# EAGLE design motherboard (EAGLE 7.1.0)
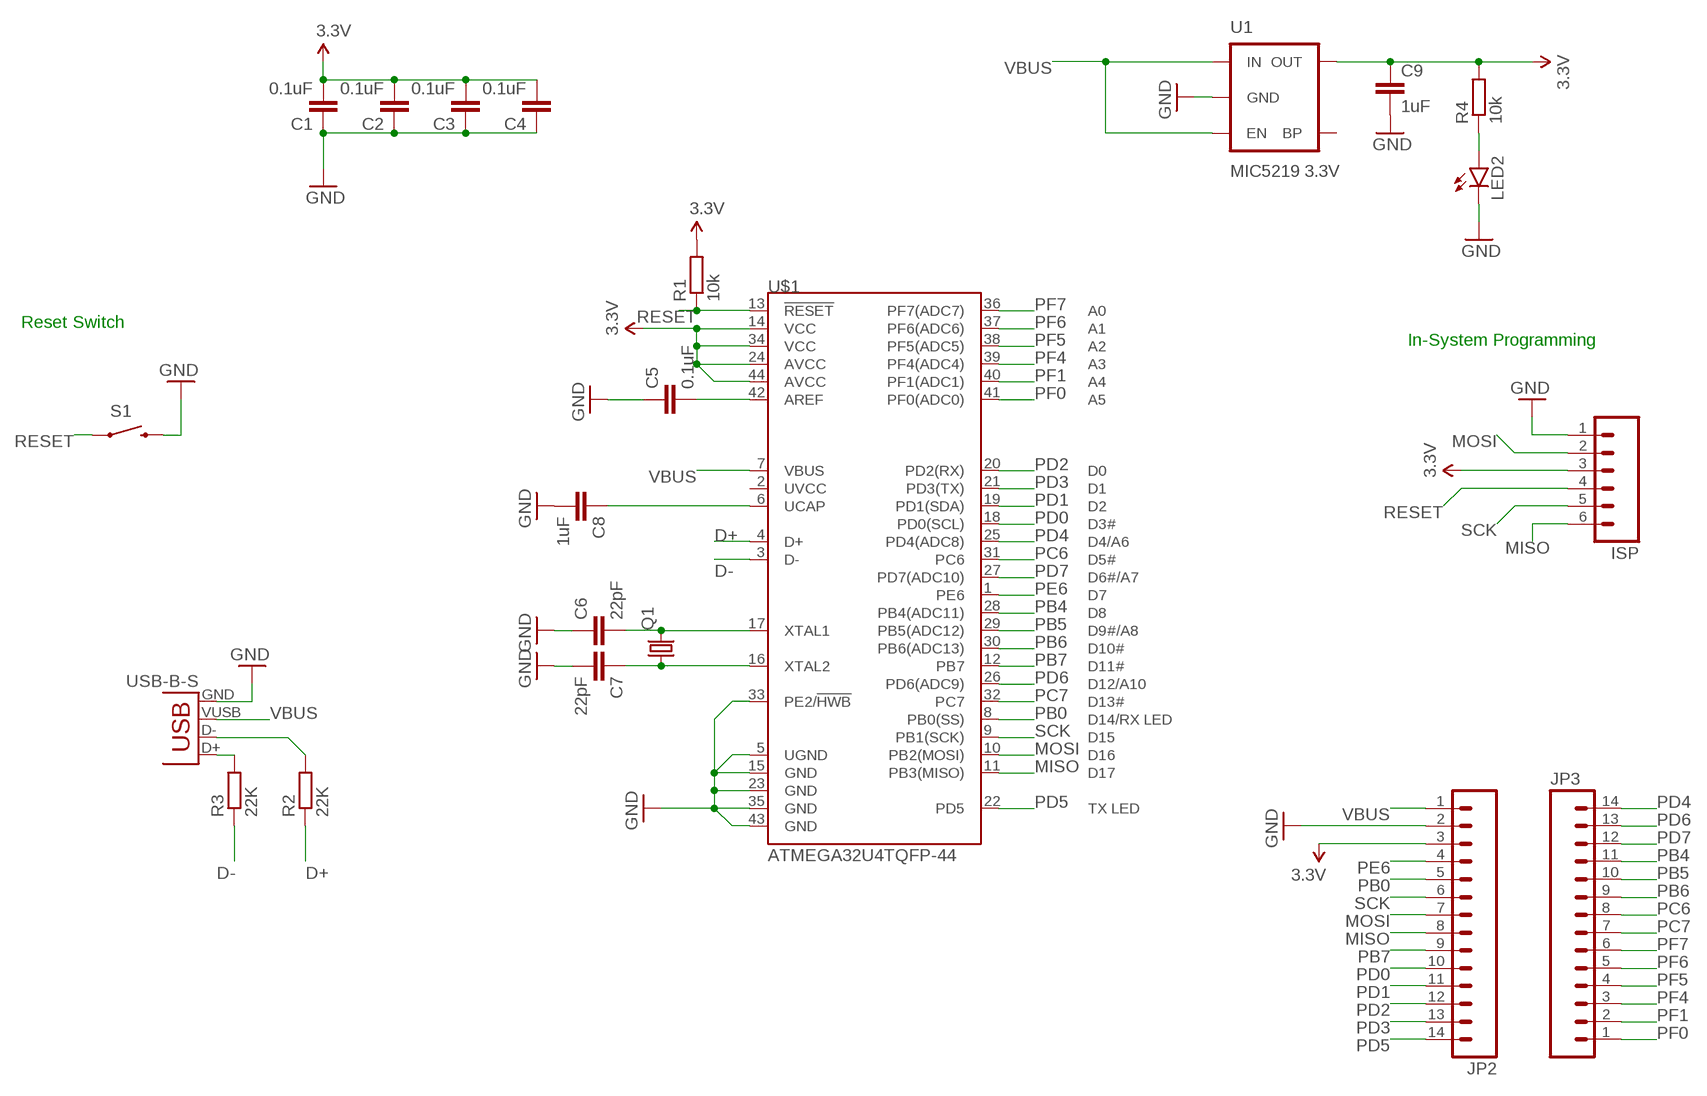
[diagram p0: schematic, sheet 1]

## Parts
C1  0.1uF  C0805  [C0805]
C2  0.1uF  C0805  [C0805]
C3  0.1uF  C0805  [C0805]
C4  0.1uF  C0805  [C0805]
C5  0.1uF  C0805  [C0805]
C6  22pF  C0805  [C0805]
C7  22pF  C0805  [C0805]
C8  1uF  C0805  [C0805]
C9  1uF  C0805  [C0805]
ISP  M06SMD  [1X06-SMD]
JP1  USB-B-S  [USB-B-SMT]
JP2  M14  [1X14]
JP3  M14  [1X14]
LED2  LED1206  [LED-1206]
Q1  CRYSTALHC49S  [HC49/S]
R1  10k  R0805  [R0805]
R2  22K  R0805  [R0805]
R3  22K  R0805  [R0805]
R4  10k  R0805  [R0805]
S1  SWITCH-MOMENTARY-2PTH  [TACTILE-PTH]
U1  MIC5219 3.3V  V_REG_MIC52193.3V  [SOT23-5]
U$1  ATMEGA32U4TQFP-44  [TQFP44]

## Nets
3.3V: C1.2 C2.2 C3.2 C4.2 C9.1 ISP.3 JP2.3 R1.2 R4.2 U1.5(OUT) U$1.14(VCC) U$1.24(AVCC) U$1.34(VCC) U$1.44(AVCC)
D+: R2.1 U$1.4(D+)
D-: R3.1 U$1.3(D-)
GND: C1.1 C2.1 C3.1 C4.1 C5.1 C6.1 C7.2 C8.2 C9.2 ISP.1 JP1.GND JP2.2 LED2.C S1.3 U1.2(GND) U$1.5(UGND) U$1.15(GND) U$1.23(GND) U$1.33(PE2/!HWB) U$1.35(GND) U$1.43(GND)
MISO: ISP.6 JP2.8 U$1.11(PB3(MISO))
MOSI: ISP.2 JP2.7 U$1.10(PB2(MOSI))
N$1: C7.1 Q1.1 U$1.16(XTAL2)
N$2: C5.2 U$1.42(AREF)
N$3: C6.2 Q1.2 U$1.17(XTAL1)
N$4: JP1.D+ R3.2
N$5: JP1.D- R2.2
N$6: LED2.A R4.1
N$10: C8.1 U$1.6(UCAP)
PB0: JP2.5 U$1.8(PB0(SS))
PB4: JP3.11 U$1.28(PB4(ADC11))
PB5: JP3.10 U$1.29(PB5(ADC12))
PB6: JP3.9 U$1.30(PB6(ADC13))
PB7: JP2.9 U$1.12(PB7)
PC6: JP3.8 U$1.31(PC6)
PC7: JP3.7 U$1.32(PC7)
PD0: JP2.10 U$1.18(PD0(SCL))
PD1: JP2.11 U$1.19(PD1(SDA))
PD2: JP2.12 U$1.20(PD2(RX))
PD3: JP2.13 U$1.21(PD3(TX))
PD4: JP3.14 U$1.25(PD4(ADC8))
PD5: JP2.14 U$1.22(PD5)
PD6: JP3.13 U$1.26(PD6(ADC9))
PD7: JP3.12 U$1.27(PD7(ADC10))
PE6: JP2.4 U$1.1(PE6)
PF0: JP3.1 U$1.41(PF0(ADC0))
PF1: JP3.2 U$1.40(PF1(ADC1))
PF4: JP3.3 U$1.39(PF4(ADC4))
PF5: JP3.4 U$1.38(PF5(ADC5))
PF6: JP3.5 U$1.37(PF6(ADC6))
PF7: JP3.6 U$1.36(PF7(ADC7))
RESET: ISP.4 R1.1 S1.1 U$1.13(!RESET)
SCK: ISP.5 JP2.6 U$1.9(PB1(SCK))
VBUS: JP1.VUSB(VBUS) JP2.1 U1.1(IN) U1.3(EN) U$1.7(VBUS)
Unconnected: U1.4(BP) U$1.2(UVCC)

## Notes on the sheet
- Reset Switch
- In-System Programming

## Library data of the parts
C1-C9 = ELL-i-Passives:C: Surface Mount Capasitors — in standard sizes A capacitor used to store energy electrostatically in an electric field. If you need a high-value capacitor, consider using a polarised capacitor to save space. Wikipedia article on capacitors <https://en.wikipedia.org/wiki/Capacitor>
ISP = SparkFun-Connectors:M06: Header 6 Standard 6-pin 0.1" header. Use with straight break away headers (SKU : PRT-00116), right angle break away headers (PRT-00553), swiss pins (PRT-00743), machine pins (PRT-00117), and female headers (PRT-00115). Molex polarized connector foot print use with SKU : PRT-08094 with associated crimp pins and housings. NOTES ON THE VARIANTS LOCK and LOCK_LONGPADS... This footprint was designed to help hold the alignment of a through-hole component (i.e. 6-pin header) while soldering it into place. You may notice that each hole has been shifted either up or down by 0.005 of an inch from it's more standard position (which is a perfectly straight line). This slight alteration caused the pins (the squares in the middle) to touch the edges of the holes. Because they are alternating, it causes a "brace" to hold the component in place. 0.005 has proven to be the perfect amount of "off-center" position when using our standard breakaway headers. Although looks a little odd when you look at the bare footprint, once you have a header in there, the alteration is very hard to notice. Also,if you push a header all the way into place, it is covered up entirely on the bottom side. This idea of altering the position of holes to aid alignment will be further integrated into the Sparkfun Library for other footprints. It can help hold any component with 3 or more connection pins.
JP1 = SparkFun-Connectors:USB: USB Connectors USB-B-PTH is fully proven SKU : PRT-00139/CONN-08278 USB-miniB is fully proven SKU : PRT-00587 USB-A-PCB is untested. USB-A-H is throughly reviewed, but untested. Spark Fun Electronics SKU : PRT-00437 USB-B-SMT is throughly reviewed, but untested. Needs silkscreen touching up. USB-A-S has not been used/tested USB-MB-H has not been used/tested USB-MICROB has been used. CONN-09505
JP2 JP3 = SparkFun-Connectors:M14: Header 14 Standard 14-pin 0.1" header. Use with straight break away headers (SKU : PRT-00116), right angle break away headers (PRT-00553), swiss pins (PRT-00743), machine pins (PRT-00117), and female headers (PRT-00115).
LED2 = SparkFun-LED:LED: LEDs Standard schematic elements and footprints for 5mm, 3mm, 1206, and 0603 sized LEDs. 5mm - Spark Fun Electronics SKU : COM-00529 (and others)
Q1 = adafruit:CRYSTAL: CRYSTAL; OC_FARNELL: 1667008; OC_NEWARK: unknown
R1-R4 = ELL-i-Passives:R: Surface Mount Resistor — in standard sizes
S1 = SparkFun-Electromechanical:SWITCH-MOMENTARY-2: Various NO switches- pushbuttons, reed, etc
U1 = SparkFun-PowerIC:V_REG_MIC5219: V_REG MIC5219 Standard 3.3V and 5V 500mA LDO voltage regulator in SOT-23 layout. Micrel part MIC5219. BP (by-pass) pin is used to lower output noise with 470pF cap, may be left open.; PROD_ID: VREG-09872
U$1 = SparkFun-DigitalIC:ATMEGA32U4: Atmel 44-pin 8-bit Microcontroller with 32KBytes of ISP Flash and USB Controller

## Board
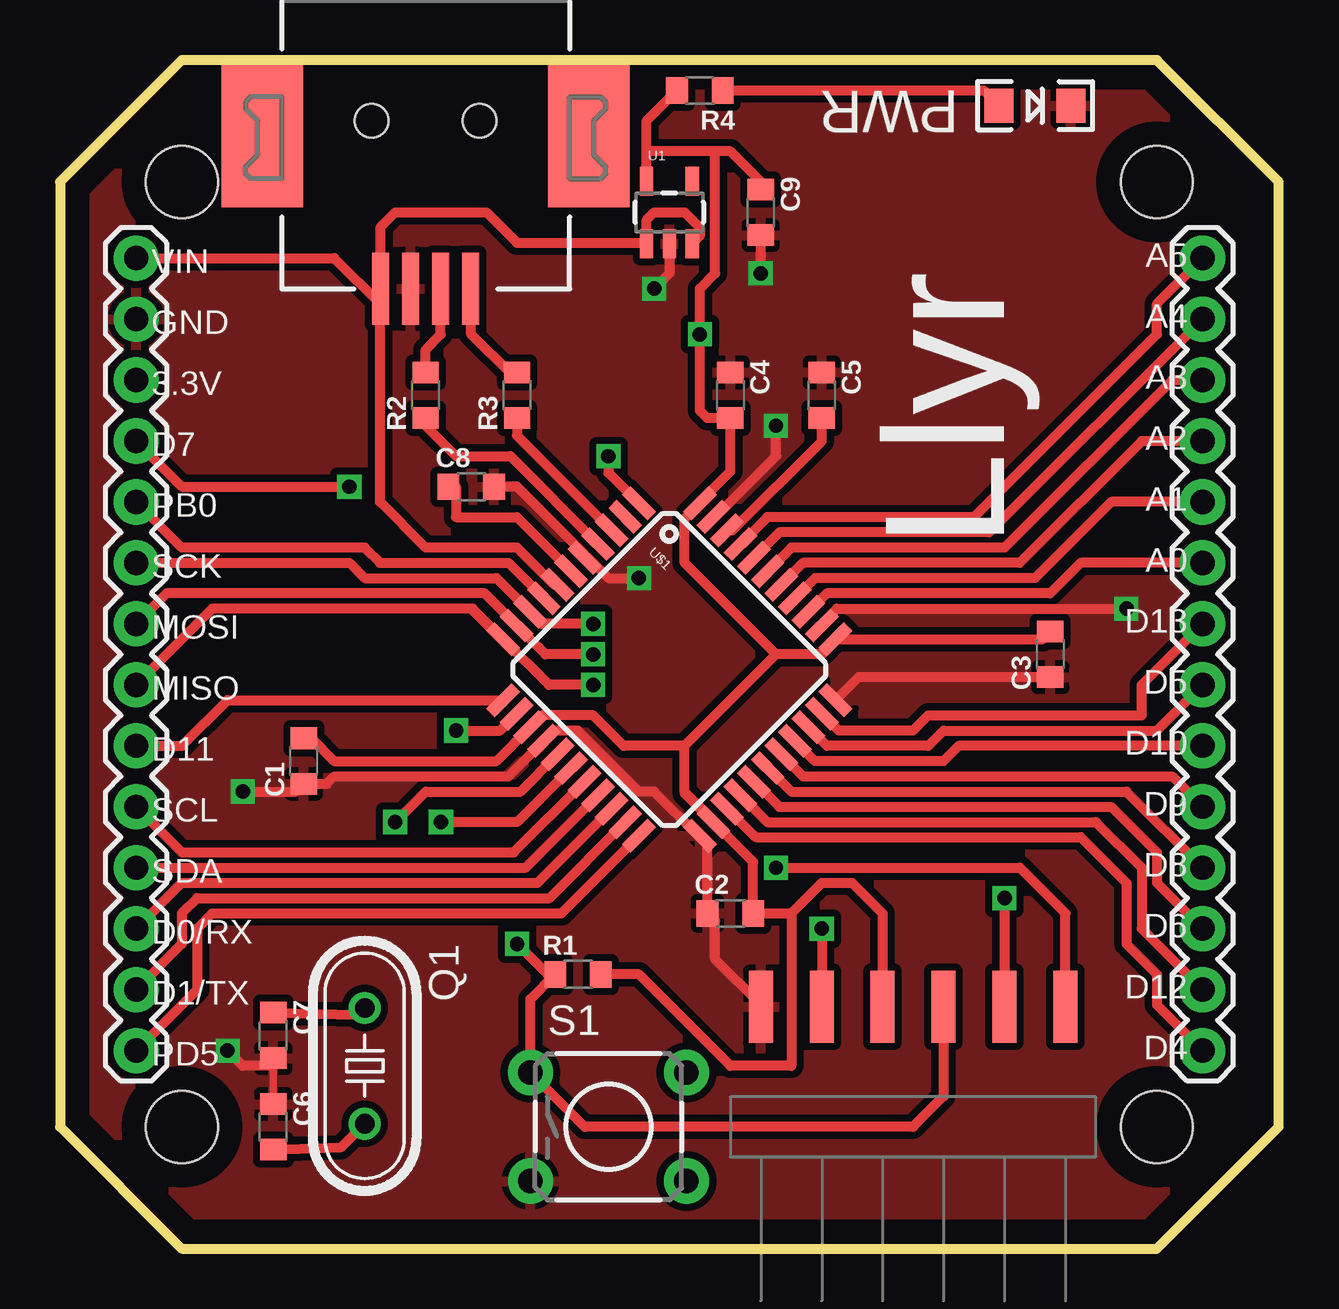
[diagram p1: board, top side]
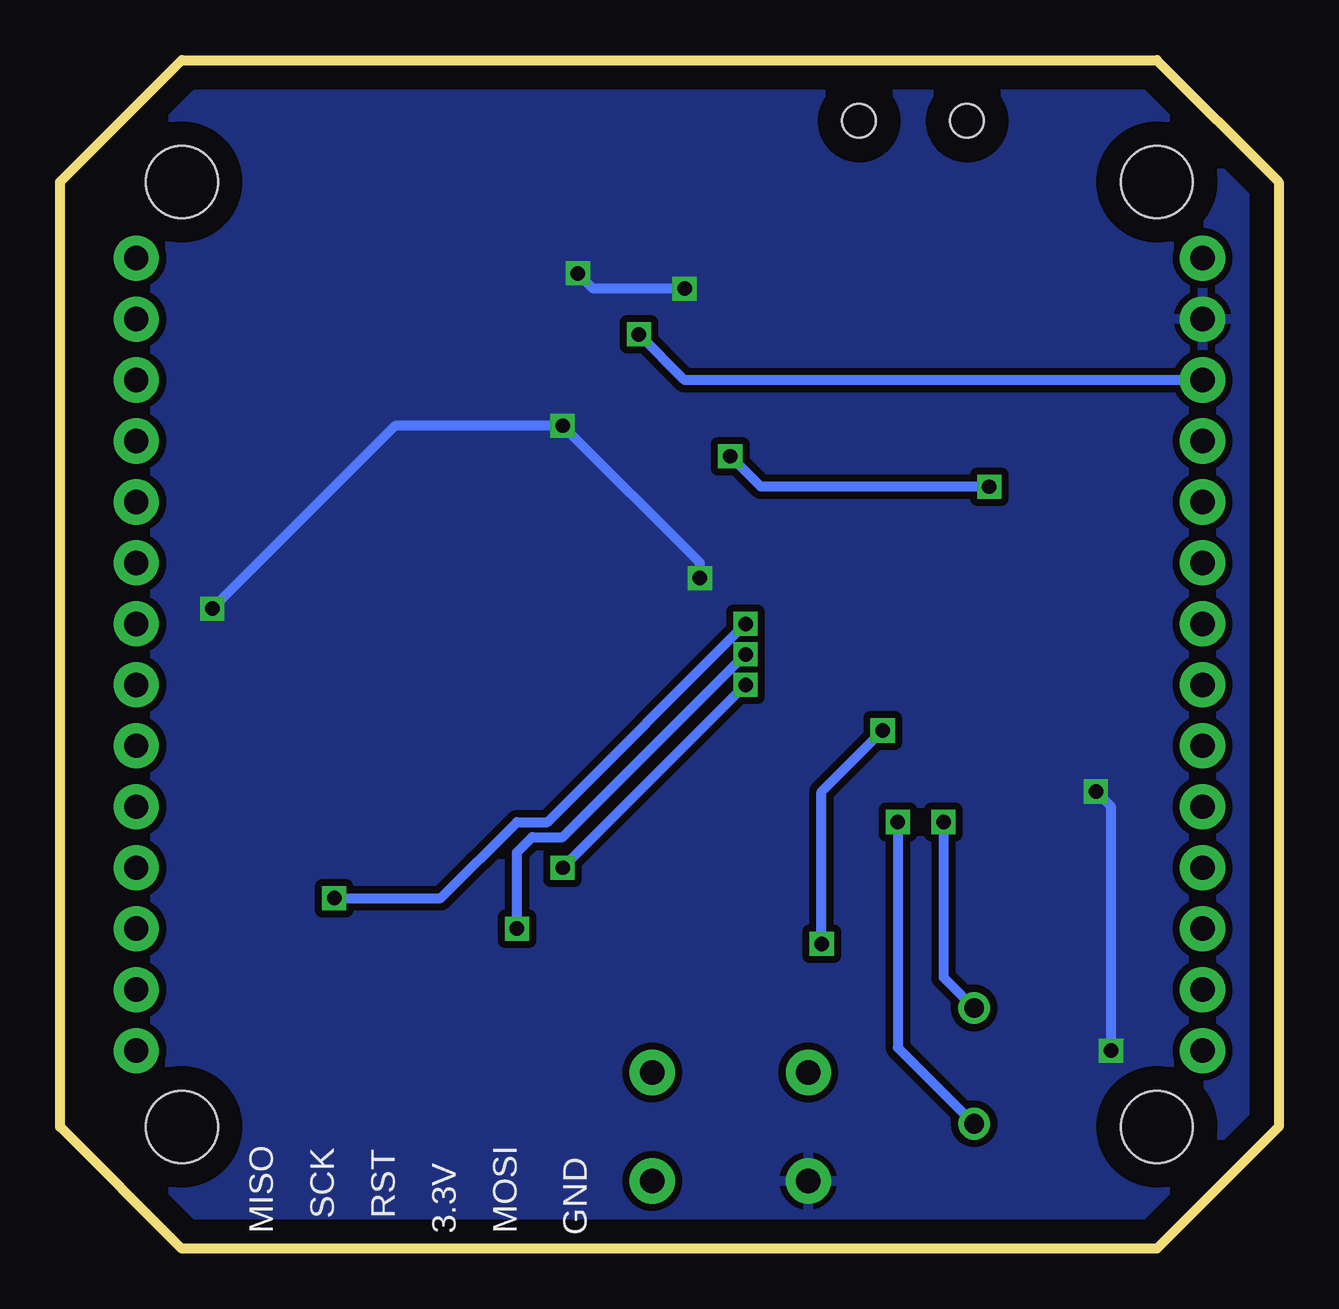
[diagram p2: board, bottom side, seen from below]

Size 50.8 x 49.53 mm. Coordinates in mm from the lower left corner, seen from the top.
Outline: 5.08,0 45.72,0 50.8,5.08 50.8,44.45 45.72,49.53 5.08,49.53 0,44.45 0,5.08 5.08,0
Copper layers (1*16): Top 0.035mm / dielectric 1.5mm / Bottom 0.035mm
Design rules "default": minimum track width 10mil, minimum drill 24mil, track to track 8mil, track to pad 8mil, pad to pad 8mil, via to via 8mil, smd to smd 8mil, copper to edge 40mil, drill to drill 8mil, minimum pad ring 10mil, minimum via ring 8mil, stop-mask expansion 4mil, vias tented up to drill 0mil, thermal gap 10mil
Holes 3 mm at 5.08,44.45 45.72,44.45 45.72,5.08 5.08,5.08

### Footprints (pad centres in the part's own frame; a part is rotated, then mirrored left to right if it is on the bottom)
C0805 = smd 0.9 x 1.1: 1 -0.95,0; 2 0.95,0
1X06-SMD = smd 1 x 3: 1 -6.35,5; 2 -3.81,5; 3 -1.27,5; 4 1.27,5; 5 3.81,5; 6 6.35,5
USB-B-SMT = smd 6.04 x 3.4: 5 0.58,6.8; 6 0.58,-6.8 | smd 3 x 0.7: D+ 7,1.875; D- 7,0.625; GND 7,-0.625; VUSB 7,-1.875 | hole 1.4: 0,2.25; 0,-2.25
1X14 = drill 1.016 pad 1.88: 1 0,0; 2 2.54,0; 3 5.08,0; 4 7.62,0; 5 10.16,0; 6 12.7,0; 7 15.24,0; 8 17.78,0; 9 20.32,0; 10 22.86,0; 11 25.4,0; 12 27.94,0; 13 30.48,0; 14 33.02,0
LED-1206 = smd 1.2 x 1.4: A -1.5,0; C 1.5,0
HC49/S = drill 0.813: 1 -2.413,0; 2 2.413,0
R0805 = smd 0.9 x 1.1: 1 -0.95,0; 2 0.95,0
TACTILE-PTH = drill 1.016 pad 1.88: 1 -3.251,2.261; 2 3.251,2.261; 3 -3.251,-2.261; 4 3.251,-2.261
SOT23-5 = smd 0.55 x 1.2: 1 -0.95,-1.3; 2 0,-1.3; 3 0.95,-1.3; 4 0.95,1.3; 5 -0.95,1.3
TQFP44 = smd 1.5 x 0.5: 1 -5.8,4; 2 -5.8,3.2; 3 -5.8,2.4; 4 -5.8,1.6; 5 -5.8,0.8; 6 -5.8,0; 7 -5.8,-0.8; 8 -5.8,-1.6; 9 -5.8,-2.4; 10 -5.8,-3.2; 11 -5.8,-4; 23 5.8,-4; 24 5.8,-3.2; 25 5.8,-2.4; 26 5.8,-1.6; 27 5.8,-0.8; 28 5.8,0; 29 5.8,0.8; 30 5.8,1.6; 31 5.8,2.4; 32 5.8,3.2; 33 5.8,4 | smd 0.5 x 1.5: 12 -4,-5.8; 13 -3.2,-5.8; 14 -2.4,-5.8; 15 -1.6,-5.8; 16 -0.8,-5.8; 17 0,-5.8; 18 0.8,-5.8; 19 1.6,-5.8; 20 2.4,-5.8; 21 3.2,-5.8; 22 4,-5.8; 34 4,5.8; 35 3.2,5.8; 36 2.4,5.8; 37 1.6,5.8; 38 0.8,5.8; 39 0,5.8; 40 -0.8,5.8; 41 -1.6,5.8; 42 -2.4,5.8; 43 -3.2,5.8; 44 -4,5.8

### Placement (x,y rotation side)
C1  10.16,20.32 90 top
C2  27.94,13.97 0 top
C3  41.28,24.76 90 top
C4  27.94,35.56 270 top
C5  31.75,35.56 270 top
C6  8.89,5.08 270 top
C7  8.89,8.89 270 top
C8  17.14,31.75 0 top
C9  29.21,43.18 270 top
ISP  35.56,5.08 0 top
JP1  15.24,46.99 270 top
JP2  3.17,41.28 270 top
JP3  47.62,41.28 270 top
LED2  40.64,47.62 0 top
Q1  12.7,7.62 270 top
R1  21.59,11.43 0 top
R2  15.24,35.56 90 top
R3  19.05,35.56 90 top
R4  26.67,48.26 180 top
S1  22.86,5.08 0 top
U1  25.4,43.18 0 top
U$1  25.4,24.13 315 top

### Tracks (layer width: path | path; a pad name or v marks a point on that pad's centre or on a via)
3.3V  (via drill 0.6)
  Top 0.406: U$1.44 26.61,31.06 | U$1.44 26.67,31.12 27.94,32.39 C4.2 | C3.2 40.96,25.4 U$1.34 32.33,25.35 31.75,24.76 29.84,24.76 | U$1.24 28.89,16.11 C2.2 30.48,13.97 | C1.2 10.48,21.27 11.43,20.32 18.2,20.32 U$1.14 20.1,22.22 22.22,22.22 23.5,20.95 26.04,20.95 | 30.48,13.97 31.75,15.24 33.02,15.24 34.29,13.97 ISP.3 | C4.2 28.26,34.61 | U1.5 24.45,45.72 | 24.45,45.72 24.45,46.99 R4.2 | C9.1 29.21,44.45 27.94,45.72 27.3,45.72 | 27.3,45.72 24.45,45.72 | C4.2 26.98,34.61 26.67,34.92 v26.67,38.1 26.67,40 27.3,40.64 27.3,45.72 | 29.84,24.76 26.04,28.57 26.04,30.42 U$1.44 | 29.84,24.76 26.04,20.95 | 26.04,19.05 26.04,18.97 U$1.24 | U$1.24 27.24,17.85 26.04,19.05 | 26.04,19.05 26.04,20.95 | 30.48,13.97 30.48,7.62 27.94,7.62 24.13,11.43 R1.2
  Bottom 0.406: JP2.3 24.76,36.19 v26.67,38.1
D+
  Top 0.406: R2.1 15.24,34.29 16.51,33.02 18.77,33.02 U$1.4
D-
  Top 0.406: R3.1 19.05,33.87 U$1.3
GND  (via drill 0.6)
  Top 0.305: 8.89,7.62 8.89,6.35 | U$1.5 21.86,28.94
  Top 0.406: U$1.35 31.76,26.05 32.39,26.67 v44.45,26.67 | JP1.GND 14.61,38.75 | C3.1 33.29,23.82 U$1.33 | ISP.1 29.21,10.16 27.3,12.07 27.3,13.66 C2.1 26.99,16.88 U$1.23 26.61,17.2 24.76,19.05 24.13,19.05 21.59,21.59 20.6,21.59 U$1.15 18.69,19.68 11.43,19.68 11.11,19.37 C1.1 9.84,19.05 v7.62,19.05 | C7.2 8.89,7.62 7.62,7.62 v6.98,8.25 | U1.2 25.4,40.64 v24.76,40 | v29.21,40.64 C9.2 | U$1.43 27.32,30.49 29.84,33.02 v29.84,34.29 | 21.86,28.94 19.05,31.75 C8.2 | U$1.5 22,28.8 22.86,27.94 v24.13,27.94
  Bottom 0.406: v6.98,8.25 6.98,18.41 v7.62,19.05 | v24.76,40 28.57,40 v29.21,40.64 | v44.45,26.67 36.83,34.29 v29.84,34.29 24.13,28.57 v24.13,27.94
  pour Top (isolate 0.305): 0,44.45 5.08,49.53 45.72,49.53 50.8,44.45 50.8,5.08 45.72,0 5.08,0 0,5.08
  pour Bottom (isolate 0.305): 0,44.45 5.08,49.53 45.72,49.53 50.8,44.45 50.8,5.08 45.72,0 5.08,0 0,5.08
MISO  (via drill 0.6)
  Top 0.406: 17.14,26.67 17.2,26.67 U$1.11 | U$1.11 18.41,25.4 17.14,26.67 | ISP.6 41.91,13.97 40,15.88 v29.84,15.88 | 17.14,26.67 6.35,26.67 JP2.8 | v22.22,23.5 20.38,23.5 U$1.11
  Bottom 0.406: v22.22,23.5 v29.84,15.88
MOSI  (via drill 0.6)
  Top 0.406: U$1.10 17.7,27.31 4.44,27.31 JP2.7 | U$1.10 19.12,25.97 | v31.75,13.34 ISP.2 | v22.22,24.76 20.24,24.76 U$1.10
  Bottom 0.406: v31.75,13.34 31.75,16.51 31.11,17.14 29.84,17.14 v22.22,24.76
N$1  (via drill 0.6)
  Top 0.406: C7.1 12.41,9.74 Q1.1 | v13.97,17.78 15.24,19.05 19.19,19.05 U$1.16
  Bottom 0.406: v13.97,17.78 13.97,11.3 Q1.1
N$2
  Top 0.406: U$1.42 28.02,29.93 31.75,33.66 C5.2
N$3  (via drill 0.6)
  Top 0.406: C6.2 11.72,4.23 Q1.2 | U$1.17 19.05,17.78 v15.87,17.78
  Bottom 0.406: v15.87,17.78 15.87,8.38 Q1.2
N$4
  Top 0.406: JP1.D+ 17.14,39.96 17.14,38.1 18.83,36.41 R3.2
N$5
  Top 0.406: R2.2 15.24,37.47 15.87,38.1 15.87,39.98 JP1.D-
N$6
  Top 0.406: R4.1 38.5,48.26 LED2.A
N$10
  Top 0.406: C8.1 16.51,31.75 16.51,30.48 19.05,30.48 | 19.05,30.48 | 19.05,30.48 U$1.6
PB0
  Top 0.406: U$1.8 18.69,28.57 13.33,28.57 12.7,29.21 5.08,29.21 JP2.5
PB4
  Top 0.406: U$1.28 30.48,19.05 44.45,19.05 JP3.11
PB5
  Top 0.406: U$1.29 30.98,19.68 46.36,19.68 JP3.10
PB6
  Top 0.406: JP3.9 37.47,20.95 36.83,20.32 31.47,20.32 U$1.30
PB7
  Top 0.406: JP2.9 5.08,20.95 6.98,22.86 U$1.12
PC6
  Top 0.406: U$1.31 31.97,20.95 36.2,20.95 36.83,21.59 45.72,21.59 JP3.8
PC7
  Top 0.406: U$1.32 32.47,21.59 35.56,21.59 36.2,22.22 45.09,22.22 45.09,23.5 JP3.7
PD0
  Top 0.406: U$1.18 18.91,16.51 5.08,16.51 JP2.10
PD1
  Top 0.406: JP2.11 19.41,15.88 U$1.19
PD2
  Top 0.406: U$1.20 19.9,15.24 5.08,15.24 JP2.12
PD3
  Top 0.406: U$1.21 20.4,14.61 5.71,14.61 5.08,13.97 5.08,12.7 JP2.13
PD4
  Top 0.406: U$1.25 28.99,17.14 42.55,17.14 44.45,15.24 44.45,12.7 45.72,11.43 45.72,10.16 JP3.14
PD5
  Top 0.406: U$1.22 20.9,13.97 6.35,13.97 5.71,13.34 5.71,10.79 JP2.14
PD6
  Top 0.406: U$1.26 29.49,17.78 43.18,17.78 45.09,15.88 45.09,13.34 JP3.13
PD7
  Top 0.406: U$1.27 29.98,18.41 43.81,18.41 45.72,16.51 45.72,15.24 JP3.12
PE6  (via drill 0.6)
  Top 0.406: v12.07,31.75 5.08,31.75 JP2.4 | v22.86,33.02 22.86,32.33 U$1.1
  Bottom 0.406: v12.07,31.75 21.59,31.75 v22.86,33.02
PF0
  Top 0.406: U$1.41 29.49,30.48 38.1,30.48 45.72,38.1 45.72,39.37 JP3.1
PF1
  Top 0.406: JP3.2 38.73,29.85 29.98,29.85 U$1.40
PF4
  Top 0.406: JP3.3 46.36,36.19 39.37,29.21 30.48,29.21 U$1.39
PF5
  Top 0.406: JP3.4 45.09,33.66 40,28.57 30.98,28.57 U$1.38
PF6
  Top 0.406: JP3.5 43.81,31.11 40.64,27.94 31.47,27.94 U$1.37
PF7
  Top 0.406: JP3.6 42.55,28.57 41.28,27.31 31.97,27.31 U$1.36
RESET  (via drill 0.6)
  Top 0.406: 19.12,22.29 U$1.13 18.33,21.59 v16.51,21.59 | ISP.4 36.83,6.35 35.56,5.08 21.87,5.08 S1.1 19.61,10.4 R1.1 20.32,11.43 v19.05,12.7
  Bottom 0.406: v19.05,12.7 19.05,19.05 v16.51,21.59
SCK  (via drill 0.6)
  Top 0.406: JP2.6 12.07,28.57 12.7,27.94 18.2,27.94 U$1.9 20.1,26.04 v22.22,26.04 | v39.37,14.61 ISP.5
  Bottom 0.406: v39.37,14.61 34.92,14.61 31.75,17.78 30.48,17.78 v22.22,26.04
VBUS
  Top 0.406: U$1.7 20.59,27.67 19.05,29.21 15.24,29.21 13.33,31.11 13.33,39.37 | 13.33,39.37 13.33,39.96 JP1.VUSB 13.36,42.58 13.97,43.18 17.78,43.18 19.05,41.91 24.42,41.91 U1.1 24.45,42.86 24.76,43.18 26.04,43.18 26.67,42.55 26.67,42.2 U1.3 | JP2.1 11.43,41.28 13.33,39.37

### Text on the board
tPlace: PWR | A5 | VIN | A4 | GND | A3 | 3.3V | A2 | D7 | A1 | PB0 | Llyr | A0 | SCK | D13 | MOSI | D5 | MISO | D10 | D11 | D9 | SCL | D8 | SDA | D6 | D0/RX | D12 | D1/TX | D4 | PD5
bPlace: GND | MOSI | 3.3V | RST | SCK | MISO